# EAGLE design avruler_touch (EAGLE 6.5.0)
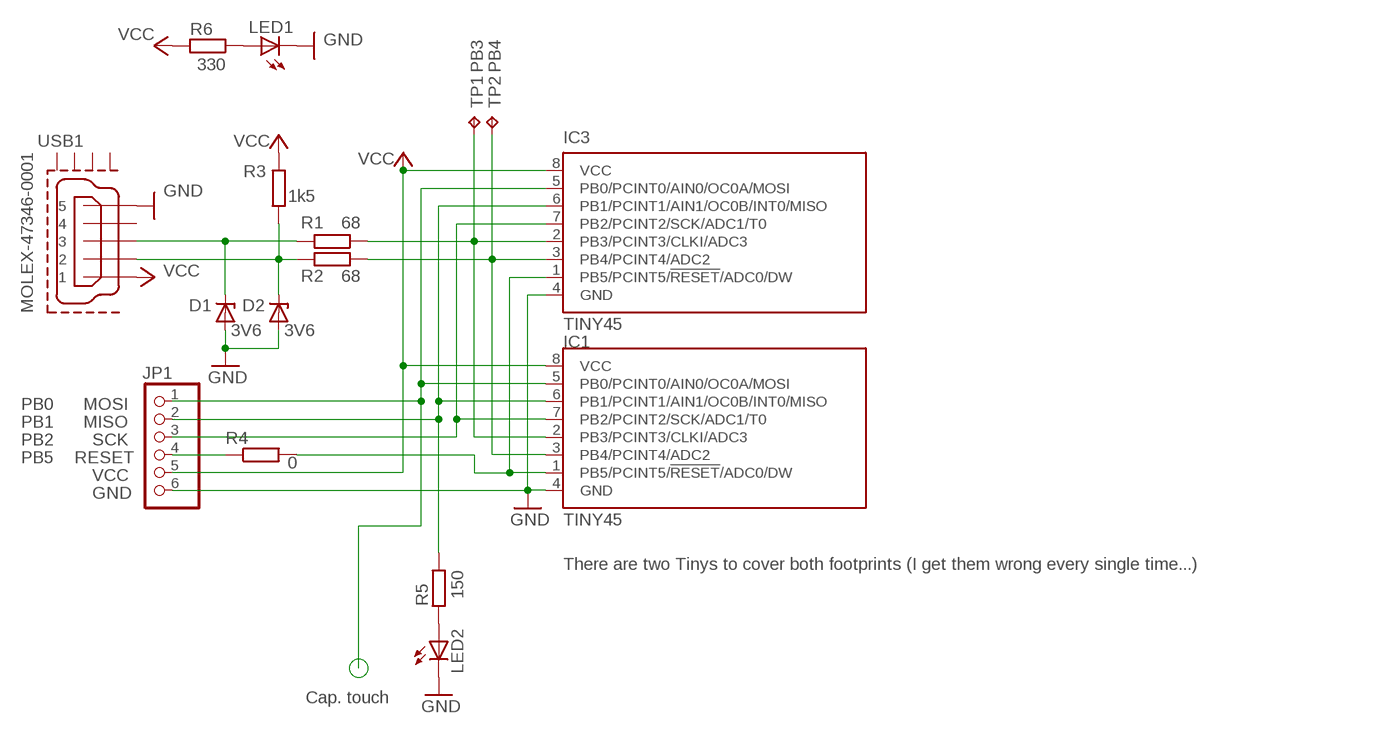
[diagram p0: schematic, sheet 1]

## Parts
D1  3V6  ZENER-DIODESOD80C  [SOD80C]
D2  3V6  ZENER-DIODESOD80C  [SOD80C]
IC1  TINY45  TINY13-20SSU  [8S1]
IC3  TINY45  TINY13-20SU  [8S2]
JP1  PINHD-1X6/90  [1X06/90]
LED1  LEDCHIPLED_1206  [CHIPLED_1206]
LED2  LEDCHIPLED_1206  [CHIPLED_1206]
R1  68  R-EU_M1206  [M1206]
R2  68  R-EU_M1206  [M1206]
R3  1k5  R-EU_M1206  [M1206]
R4  0  R-EU_M1206  [M1206]
R5  150  R-EU_M1206  [M1206]
R6  330  R-EU_M1206  [M1206]
TP1  TPTP14SQ  [TP14SQ]
TP2  TPTP14SQ  [TP14SQ]
USB1  MOLEX-47346-0001  [MOLEX-47364-0001]

## Nets
GND: D1.A D2.A IC1.4(GND) IC3.4(GND) JP1.6 LED1.C LED2.C USB1.5
N$1: IC1.1(PB5/PCINT5/!RESET!/ADC0/DW) IC3.1(PB5/PCINT5/!RESET!/ADC0/DW) R4.2
N$2: IC1.2(PB3/PCINT3/CLKI/ADC3) IC3.2(PB3/PCINT3/CLKI/ADC3) R1.1 TP1.TP
N$3: IC1.3(PB4/PCINT4/ADC2) IC3.3(PB4/PCINT4/ADC2) R2.1 TP2.TP
N$4: IC1.5(PB0/PCINT0/AIN0/OC0A/MOSI) IC3.5(PB0/PCINT0/AIN0/OC0A/MOSI) JP1.1
N$5: IC1.6(PB1/PCINT1/AIN1/OC0B/INT0/MISO) IC3.6(PB1/PCINT1/AIN1/OC0B/INT0/MISO) JP1.2 R5.1
N$6: IC1.7(PB2/PCINT2/SCK/ADC1/T0) IC3.7(PB2/PCINT2/SCK/ADC1/T0) JP1.3
N$7: D2.C R2.2 R3.2 USB1.2
N$8: D1.C R1.2 USB1.3
N$10: JP1.4 R4.1
N$165: LED1.A R6.1
N$193: LED2.A R5.2
VCC: IC1.8(VCC) IC3.8(VCC) JP1.5 R3.1 R6.2 USB1.1
Unconnected: USB1.4 USB1.GND1 USB1.GND2 USB1.GND3 USB1.GND4

## Notes on the sheet
- PB3 | PB4
- PB0 | MOSI
- PB1 | MISO
- PB2 | SCK
- PB5 | RESET
- VCC
- GND
- There are two Tinys to cover both footprints (I get them wrong every single time...)
- Cap. touch

## Library data of the parts
D1 D2 = diode:ZENER-DIODE: Z-Diode
IC1 = atmel:TINY13: 8-bit AVR Microcontroller with 1K Bytes In-System Programmable Flash Source: http://www.atmel.com/dyn/resources/prod_documents/2535S.pdf; MPN: ATTINY13-20SSU; OC_FARNELL: 1455133; OC_NEWARK: 58M3771
IC3 = atmel:TINY13: 8-bit AVR Microcontroller with 1K Bytes In-System Programmable Flash Source: http://www.atmel.com/dyn/resources/prod_documents/2535S.pdf; MPN: ATTINY13-20SU; OC_FARNELL: 9171568; OC_NEWARK: 96K6522
JP1 = pinhead:PINHD-1X6: PIN HEADER
LED1 LED2 = led:LED: LED OSRAM: - CHIPLED LG R971, LG N971, LY N971, LG Q971, LY Q971, LO R971, LY R971 LH N974, LH R974 LS Q976, LO Q976, LY Q976 LO Q996 - Hyper CHIPLED LW Q18S LB Q993, LB Q99A, LB R99A - SideLED LS A670, LO A670, LY A670, LG A670, LP A670 LB A673, LV A673, LT A673, LW A673 LH A674 LY A675 LS A676, LA A676, LO A676, LY A676, LW A676 LS A679, LY A679, LG A679 - Hyper Micro SIDELED® LS Y876, LA Y876, LO Y876, LY Y876 LT Y87S - SmartLED LW L88C, LW L88S LB L89C, LB L89S, LG L890 LS L89K, LO L89K, LY L89K LS L896, LA L896, LO L896, LY L896 - TOPLED LS T670, LO T670, LY T670, LG T670, LP T670 LSG T670, LSP T670, LSY T670, LOP T670, LYG T670 LG T671, LOG T671, LSG T671 LB T673, LV T673, LT T673, LW T673 LH T674 LS T676, LA T676, LO T676, LY T676, LB T676, LH T676, LSB T676, LW T676 LB T67C, LV T67C, LT T67C, LS T67K, LO T67K, LY T67K, LW E67C LS E67B, LA E67B, LO E67B, LY E67B, LB E67C, LV E67C, LT E67C LW T67C LS T679, LY T679, LG T679 LS T770, LO T770, LY T770, LG T770, LP T770 LB T773, LV T773, LT T773, LW T773 LH T774 LS E675, LA E675, LY E675, LS T675 LS T776, LA T776, LO T776, LY T776, LB T776 LHGB T686 LT T68C, LB T68C - Hyper Mini TOPLED® LB M676 - Mini TOPLED Santana® LG M470 LS M47K, LO M47K, LY M47K Source: http://www.osram.convergy.de LUXEON: - LUMILED® LXK2-PW12-R00, LXK2-PW12-S00, LXK2-PW14-U00, LXK2-PW14-V00 LXK2-PM12-R00, LXK2-PM12-S00, LXK2-PM14-U00 LXK2-PE12-Q00, LXK2-PE12-R00, LXK2-PE12-S00, LXK2-PE14-T00, LXK2-PE14-U00 LXK2-PB12-K00, LXK2-PB12-L00, LXK2-PB12-M00, LXK2-PB14-N00, LXK2-PB14-P00, LXK2-PB14-Q00 LXK2-PR12-L00, LXK2-PR12-M00, LXK2-PR14-Q00, LXK2-PR14-R00 LXK2-PD12-Q00, LXK2-PD12-R00, LXK2-PD12-S00 LXK2-PH12-R00, LXK2-PH12-S00 LXK2-PL12-P00, LXK2-PL12-Q00, LXK2-PL12-R00 Source: www.luxeon.com KINGBRIGHT: KA-3528ASYC Source: www.kingbright.com
R1-R6 = resistor:R-EU_: RESISTOR, European symbol
TP1 TP2 = testpad:TP: Test pad
USB1 = usb_con-update:MOLEX-47346-0001: MICRO USB B, BOTTOM MOUNT

## Board
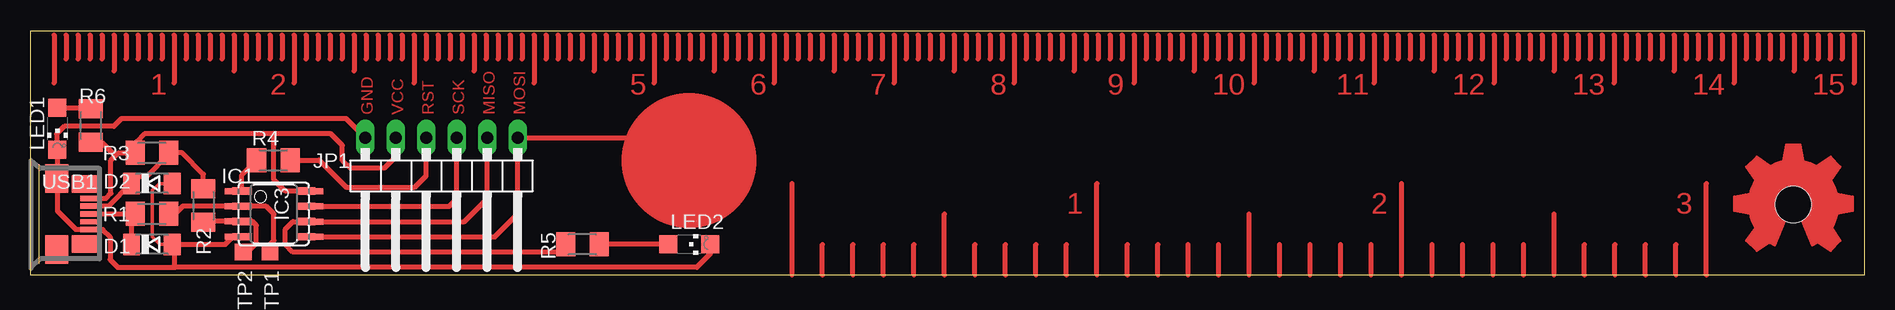
[diagram p1: board, top side]

Size 152.88 x 20.31 mm. Coordinates in mm from the lower left corner, seen from the top.
Outline: 0,0 152.88,0 152.88,20.31 0,20.31 0,0
Copper layers (1*16): Top 0.035mm / dielectric 1.5mm / Bottom 0.035mm
Design rules "default": minimum track width 10mil, minimum drill 24mil, track to track 8mil, track to pad 8mil, pad to pad 8mil, via to via 8mil, smd to smd 8mil, copper to edge 40mil, drill to drill 8mil, minimum pad ring 10mil, minimum via ring 8mil, stop-mask expansion 4mil, vias tented up to drill 0mil, thermal gap 10mil
Holes 3 mm at 146.95,5.86

### Footprints (pad centres in the part's own frame; a part is rotated, then mirrored left to right if it is on the bottom)
SOD80C = smd 1.4 x 1.8: A 1.7,0; C -1.7,0
8S1 = smd 0.6 x 1.6: 1 -1.905,-2.654; 2 -0.645,-2.654; 3 0.625,-2.654; 4 1.895,-2.654; 5 1.905,2.654; 6 0.635,2.654; 7 -0.635,2.654; 8 -1.905,2.654
8S2 = smd 0.5 x 1.4: 1 -1.905,-3.404; 2 -0.645,-3.404; 3 0.625,-3.404; 4 1.895,-3.404; 5 1.905,3.404; 6 0.635,3.404; 7 -0.635,3.404; 8 -1.905,3.404
1X06/90 = drill 1.016 long: 1 -6.35,-3.81; 2 -3.81,-3.81; 3 -1.27,-3.81; 4 1.27,-3.81; 5 3.81,-3.81; 6 6.35,-3.81
CHIPLED_1206 = smd 1.5 x 1.5: A 0,-1.75; C 0,1.75
M1206 = smd 1.6 x 2: 1 -1.4,0; 2 1.4,0
TP14SQ = smd 1.4 x 1.4: TP 0,0
MOLEX-47364-0001 = smd 1.7 x 0.45: 1 2.8,1.3; 2 2.8,0.65; 3 2.8,0; 4 2.8,-0.65; 5 2.8,-1.3 | smd 1.9 x 2.375: GND1 0,2.95; GND4 0,-2.95 | smd 2.1 x 1.475: GND2 2.3,2.5; GND3 2.3,-2.5

### Placement (x,y rotation side)
D1  10.16,2.54 0 top
D2  10.16,7.62 0 top
IC1  20.32,5.08 270 top
IC3  20.32,5.08 270 top
JP1  34.29,7.62 180 top
LED1  2.29,12.19 180 top
LED2  54.93,2.54 270 top
R1  10.16,5.08 180 top
R2  14.46,5.78 90 top
R3  10.16,10.16 0 top
R4  20.28,9.55 180 top
R5  46.04,2.54 0 top
R6  5.08,12.45 270 top
TP1  20,1.91 0 top
TP2  17.78,1.91 0 top
U$1  [OSHW_FILLX350_NOTEXT]  142,2 0 top
USB1  2.22,5.08 0 top

### Tracks (layer width: path | path; a pad name or v marks a point on that pad's centre or on a via)
GND
  Top 0.305: D1.A 10.83,2.54 10.2,3.17 10.2,7.04 10.75,7.6 11.84,7.6 D2.A
  Top 0.406: IC1.4 IC3.4 16.27,2.54 D1.A 12.06,2.33 12.06,0.64 | JP1.6 26.35,13.02 7.62,13.02 6.99,12.38 2.86,12.38 2.22,11.75 2.22,10.51 LED1.C 2.29,5.33 3.84,3.78 USB1.5 6.06,3.78 6.67,3.17 6.67,1.27 7.3,0.64 11.75,0.64 12.06,0.64 | LED2.C 56.68,1.75 55.56,0.64 12.06,0.64
N$1
  Top 0.406: IC3.1 IC1.1 17.67,8.34 R4.2
N$2
  Top 0.406: R1.1 12.1,5.08 12.77,5.75 16.89,5.75 IC3.2 IC1.2 19.68,5.71 20.32,5.08 20.32,2.86 20,2.54 TP1.TP
N$3
  Top 0.406: IC1.3 IC3.3 | IC1.3 14.53,4.46 R2.1 | TP2.TP 18.12,1.91 18.86,2.64 18.86,4.12 18.52,4.45 IC1.3
N$4
  Top 0.406: IC1.5 IC3.5 38.73,3.17 40.64,5.08 JP1.1 50.16,11.43
N$5
  Top 0.406: JP1.2 38.1,6.35 36.2,4.45 IC3.6 IC1.6 21.91,4.45 21.27,3.81 21.27,2.54 21.91,1.91 44,1.91 R5.1
N$6
  Top 0.406: IC1.7 IC3.7 34.92,5.71 35.56,6.35 JP1.3
N$7
  Top 0.406: USB1.2 5.34,5.73 6.52,5.73 8.41,7.62 D2.C 9.02,8.18 9.67,8.18 11.56,10.08 R3.2 12.7,10.16 14.46,8.4 R2.2
N$8
  Top 0.406: USB1.3 R1.2 8.46,4.78 D1.C
N$9
  Top 0.406: 143,20 143,18
N$10
  Top 0.406: R4.1 24.1,9.55 26.35,7.3 32.07,7.3 33.02,8.26 JP1.4
N$11
  Top 0.406: 2,20 2,16
N$12
  Top 0.406: 3,20 3,18
N$13
  Top 0.406: 4,20 4,18
N$14
  Top 0.406: 5,20 5,18
N$15
  Top 0.406: 6,20 6,18
N$16
  Top 0.406: 7,20 7,17
N$17
  Top 0.406: 8,20 8,18
N$18
  Top 0.406: 9,20 9,18
N$19
  Top 0.406: 10,20 10,18
N$20
  Top 0.406: 11,20 11,18
N$21
  Top 0.406: 12,20 12,16
N$22
  Top 0.406: 13,20 13,18
N$23
  Top 0.406: 14,20 14,18
N$24
  Top 0.406: 15,20 15,18
N$25
  Top 0.406: 16,20 16,18
N$26
  Top 0.406: 17,20 17,17
N$27
  Top 0.406: 18,20 18,18
N$28
  Top 0.406: 19,20 19,18
N$29
  Top 0.406: 20,20 20,18
N$30
  Top 0.406: 21,20 21,18
N$31
  Top 0.406: 22,20 22,16
N$32
  Top 0.406: 23,20 23,18
N$33
  Top 0.406: 24,20 24,18
N$34
  Top 0.406: 25,20 25,18
N$35
  Top 0.406: 26,20 26,18
N$36
  Top 0.406: 27,20 27,17
N$37
  Top 0.406: 28,20 28,18
N$38
  Top 0.406: 29,20 29,18
N$39
  Top 0.406: 30,20 30,18
N$40
  Top 0.406: 31,20 31,18
N$41
  Top 0.406: 32,20 32,16
N$42
  Top 0.406: 33,20 33,18
N$43
  Top 0.406: 34,20 34,18
N$44
  Top 0.406: 35,20 35,18
N$45
  Top 0.406: 36,20 36,18
N$46
  Top 0.406: 37,20 37,17
N$47
  Top 0.406: 38,20 38,18
N$48
  Top 0.406: 39,20 39,18
N$49
  Top 0.406: 40,20 40,18
N$50
  Top 0.406: 41,20 41,18
N$51
  Top 0.406: 42,20 42,16
N$52
  Top 0.406: 43,20 43,18
N$53
  Top 0.406: 44,20 44,18
N$54
  Top 0.406: 45,20 45,18
N$55
  Top 0.406: 46,20 46,18
N$56
  Top 0.406: 47,20 47,17
N$57
  Top 0.406: 48,20 48,18
N$58
  Top 0.406: 49,20 49,18
N$59
  Top 0.406: 50,20 50,18
N$60
  Top 0.406: 51,20 51,18
N$61
  Top 0.406: 52,20 52,16
N$62
  Top 0.406: 53,20 53,18
N$63
  Top 0.406: 54,20 54,18
N$64
  Top 0.406: 55,20 55,18
N$65
  Top 0.406: 56,20 56,18
N$66
  Top 0.406: 57,20 57,17
N$67
  Top 0.406: 58,20 58,18
N$68
  Top 0.406: 59,20 59,18
N$69
  Top 0.406: 60,20 60,18
N$70
  Top 0.406: 61,20 61,18
N$71
  Top 0.406: 62,20 62,16
N$72
  Top 0.406: 63,20 63,18
N$73
  Top 0.406: 64,20 64,18
N$74
  Top 0.406: 65,20 65,18
N$75
  Top 0.406: 66,20 66,18
N$76
  Top 0.406: 67,20 67,17
N$77
  Top 0.406: 68,20 68,18
N$78
  Top 0.406: 69,20 69,18
N$79
  Top 0.406: 70,20 70,18
N$80
  Top 0.406: 71,20 71,18
N$81
  Top 0.406: 72,20 72,16
N$82
  Top 0.406: 73,20 73,18
N$83
  Top 0.406: 74,20 74,18
N$84
  Top 0.406: 75,20 75,18
N$85
  Top 0.406: 76,20 76,18
N$86
  Top 0.406: 77,20 77,17
N$87
  Top 0.406: 78,20 78,18
N$88
  Top 0.406: 79,20 79,18
N$89
  Top 0.406: 80,20 80,18
N$90
  Top 0.406: 81,20 81,18
N$91
  Top 0.406: 82,20 82,16
N$92
  Top 0.406: 83,20 83,18
N$93
  Top 0.406: 84,20 84,18
N$94
  Top 0.406: 85,20 85,18
N$95
  Top 0.406: 86,20 86,18
N$96
  Top 0.406: 87,20 87,17
N$97
  Top 0.406: 88,20 88,18
N$98
  Top 0.406: 89,20 89,18
N$99
  Top 0.406: 90,20 90,18
N$100
  Top 0.406: 91,20 91,18
N$101
  Top 0.406: 92,20 92,16
N$102
  Top 0.406: 93,20 93,18
N$103
  Top 0.406: 94,20 94,18
N$104
  Top 0.406: 95,20 95,18
N$105
  Top 0.406: 96,20 96,18
N$106
  Top 0.406: 97,20 97,17
N$107
  Top 0.406: 98,20 98,18
N$108
  Top 0.406: 99,20 99,18
N$109
  Top 0.406: 100,20 100,18
N$110
  Top 0.406: 101,20 101,18
N$111
  Top 0.406: 102,20 102,16
N$112
  Top 0.406: 103,20 103,18
N$113
  Top 0.406: 104,20 104,18
N$114
  Top 0.406: 105,20 105,18
N$115
  Top 0.406: 106,20 106,18
N$116
  Top 0.406: 107,20 107,17
N$117
  Top 0.406: 108,20 108,18
N$118
  Top 0.406: 109,20 109,18
N$119
  Top 0.406: 110,20 110,18
N$120
  Top 0.406: 111,20 111,18
N$121
  Top 0.406: 112,20 112,16
N$122
  Top 0.406: 113,20 113,18
N$123
  Top 0.406: 114,20 114,18
N$124
  Top 0.406: 115,20 115,18
N$125
  Top 0.406: 116,20 116,18
N$126
  Top 0.406: 117,20 117,17
N$127
  Top 0.406: 118,20 118,18
N$128
  Top 0.406: 119,20 119,18
N$129
  Top 0.406: 120,20 120,18
N$130
  Top 0.406: 121,20 121,18
N$131
  Top 0.406: 122,20 122,16
N$132
  Top 0.406: 123,20 123,18
N$133
  Top 0.406: 124,20 124,18
N$134
  Top 0.406: 125,20 125,18
N$135
  Top 0.406: 126,20 126,18
N$136
  Top 0.406: 127,20 127,17
N$137
  Top 0.406: 128,20 128,18
N$138
  Top 0.406: 129,20 129,18
N$139
  Top 0.406: 130,20 130,18
N$140
  Top 0.406: 131,20 131,18
N$141
  Top 0.406: 132,20 132,16
N$142
  Top 0.406: 133,20 133,18
N$143
  Top 0.406: 134,20 134,18
N$144
  Top 0.406: 135,20 135,18
N$145
  Top 0.406: 136,20 136,18
N$146
  Top 0.406: 137,20 137,17
N$147
  Top 0.406: 138,20 138,18
N$148
  Top 0.406: 139,20 139,18
N$149
  Top 0.406: 140,20 140,18
N$150
  Top 0.406: 141,20 141,18
N$151
  Top 0.406: 142,20 142,16
N$152
  Top 0.406: 144,20 144,18
N$153
  Top 0.406: 145,20 145,18
N$154
  Top 0.406: 146,20 146,18
N$155
  Top 0.406: 147,20 147,17
N$156
  Top 0.406: 148,20 148,18
N$157
  Top 0.406: 149,20 149,18
N$158
  Top 0.406: 150,20 150,18
N$159
  Top 0.406: 151,20 151,18
N$160
  Top 0.406: 152,20 152,16
N$161
  Top 0.406: 63.5,0 63.5,7.62
N$162
  Top 0.406: 66.04,0 66.04,2.54
N$163
  Top 0.406: 68.58,0 68.58,2.54
N$164
  Top 0.406: 71.12,0 71.12,2.54
N$165
  Top 0.406: LED1.A 4.98,13.94 R6.1
N$166
  Top 0.406: 73.66,0 73.66,2.54
N$167
  Top 0.406: 76.2,0 76.2,5.08
N$168
  Top 0.406: 78.74,0 78.74,2.54
N$169
  Top 0.406: 81.28,0 81.28,2.54
N$170
  Top 0.406: 83.82,0 83.82,2.54
N$171
  Top 0.406: 86.36,0 86.36,2.54
N$172
  Top 0.406: 88.9,0 88.9,7.62
N$173
  Top 0.406: 91.44,0 91.44,2.54
N$174
  Top 0.406: 93.98,0 93.98,2.54
N$175
  Top 0.406: 96.52,0 96.52,2.54
N$176
  Top 0.406: 99.06,0 99.06,2.54
N$177
  Top 0.406: 101.6,0 101.6,5.08
N$178
  Top 0.406: 104.14,0 104.14,2.54
N$179
  Top 0.406: 106.68,0 106.68,2.54
N$180
  Top 0.406: 109.22,0 109.22,2.54
N$181
  Top 0.406: 111.76,0 111.76,2.54
N$182
  Top 0.406: 114.3,0 114.3,7.62
N$183
  Top 0.406: 116.84,0 116.84,2.54
N$184
  Top 0.406: 119.38,0 119.38,2.54
N$185
  Top 0.406: 121.92,0 121.92,2.54
N$186
  Top 0.406: 124.46,0 124.46,2.54
N$187
  Top 0.406: 127,0 127,5.08
N$188
  Top 0.406: 129.54,0 129.54,2.54
N$189
  Top 0.406: 132.08,0 132.08,2.54
N$190
  Top 0.406: 134.62,0 134.62,2.54
N$191
  Top 0.406: 137.16,0 137.16,2.54
N$192
  Top 0.406: 139.7,0 139.7,7.62
N$193
  Top 0.406: LED2.A R5.2
VCC
  Top 0.406: USB1.1 6.33,6.38 6.74,6.78 6.74,9.54 7.11,9.91 | 7.11,9.91 7.36,10.17 R3.1 8.89,10.29 8.89,11.11 9.53,11.75 20.32,11.75 | IC3.8 IC1.8 21.27,6.99 20.32,7.94 20.32,11.75 | R6.2 5.97,11.05 7.11,9.91 | JP1.5 30.48,9.84 29.53,8.89 26.67,8.89 26.04,9.53 26.04,10.79 25.08,11.75 20.32,11.75
(copper drawn outside any net)
  shapes: Top area x1, Top circle x17

### Text on the board
Top: 1 | 2 | 5 | 6 | 7 | 8 | 9 | 10 | 11 | 12 | 13 | 14 | 15 | GND | VCC | RST | SCK | MISO | MOSI | 1 | 2 | 3